# Altium project Sensor Breakout Board.PrjPcb
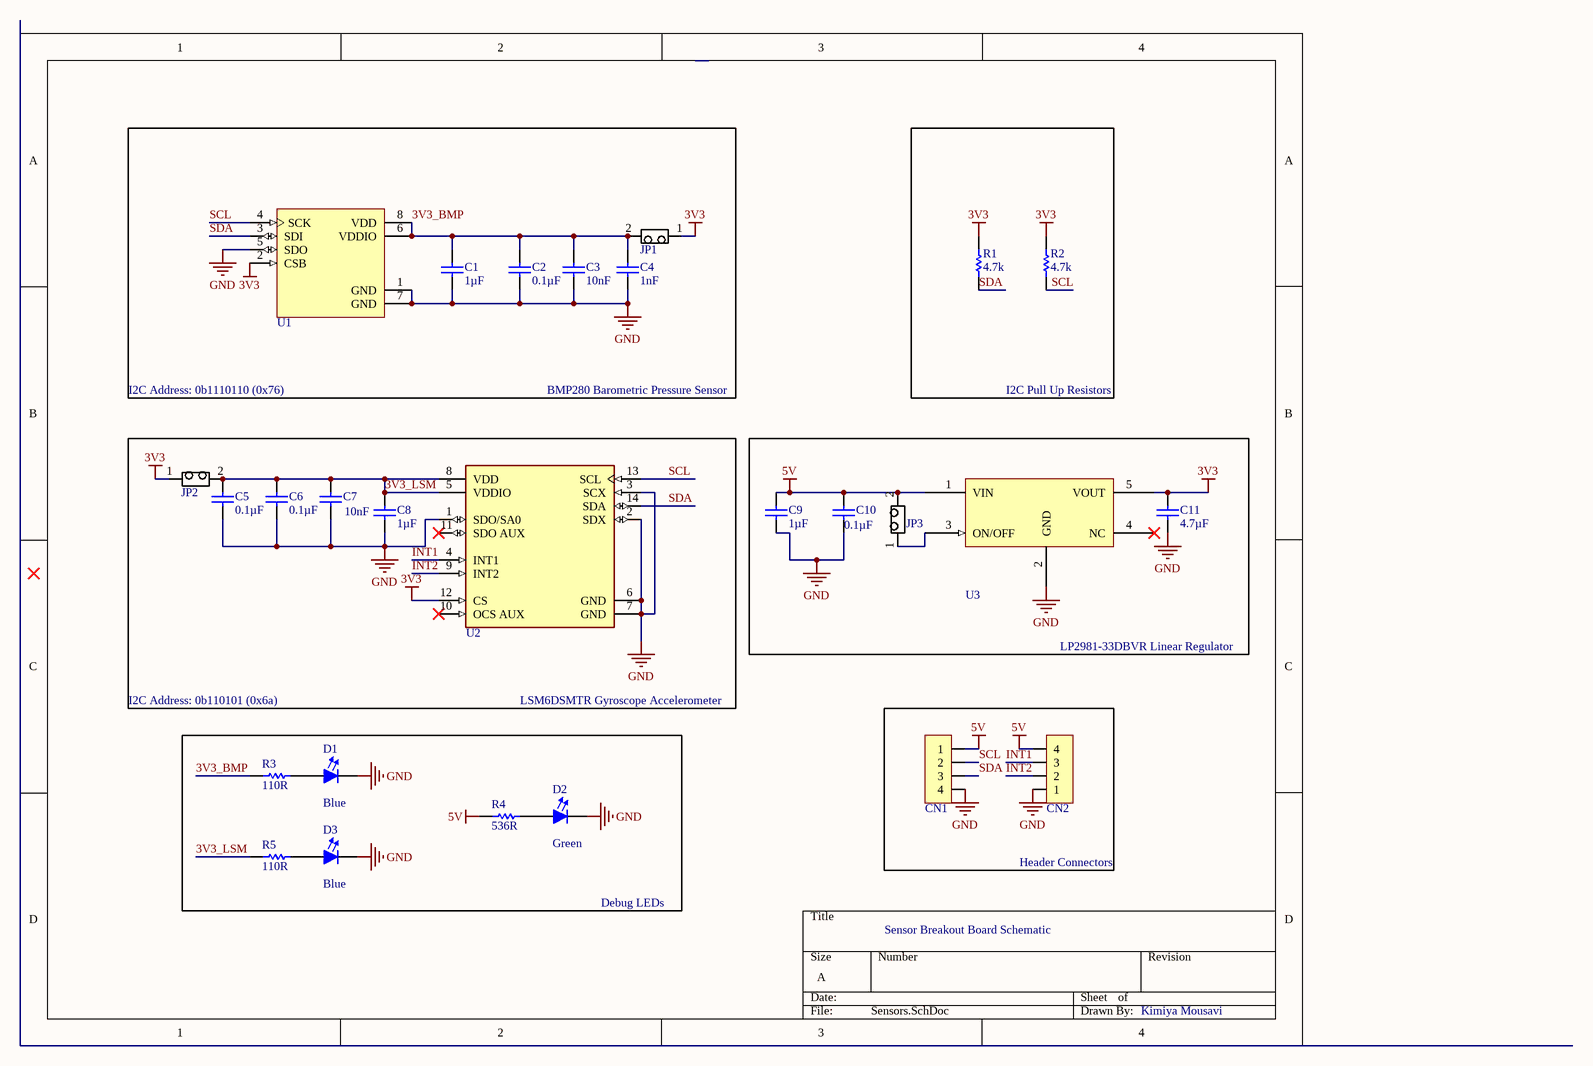
[diagram p0: Sensors.SchDoc]
1 sheet, 27 parts. Net scope: global (net labels, ports and power ports of the same name join across sheets).
Board file: Sensor Breakout.PcbDoc

## Sheet Sensors.SchDoc
size A

### Parts
C1  value 1µF  [CAPC1608N(0603")]  (hidden comment: 1uF 25V 0603 SMD, Ceramic)
C2  Capacitance: 0.1µF  [CAPC1608N(0603")]  (hidden comment: 0.1uF, 50V, 10%, X7R, 0603)
C3  value 10nF  [CAPC1608N(0603")]  (hidden comment: 10 nF, 50V 0603 SMD, Ceramic)
C4  value 1nF  [CAPC1608N(0603")]  (hidden comment: 1nF, Ceramic, 50V, +-1%, SMD, NP0)
C5  Capacitance: 0.1µF  [CAPC1608N(0603")]  (hidden comment: 0.1uF, 50V, 10%, X7R, 0603)
C6  Capacitance: 0.1µF  [CAPC1608N(0603")]  (hidden comment: 0.1uF, 50V, 10%, X7R, 0603)
C7  value 10nF  [CAPC1608N(0603")]  (hidden comment: 10 nF, 50V 0603 SMD, Ceramic)
C8  value 1µF  [CAPC1608N(0603")]  (hidden comment: 1uF 25V 0603 SMD, Ceramic)
C9  value 1µF  [CAPC1608N(0603")]  (hidden comment: 1uF 25V 0603 SMD, Ceramic)
C10  value 0.1µF  [CAPC1608N(0603")]  (hidden comment: 0.1uF 16V 0603 SMD, Ceramic)
C11  value 4.7µF  [CAPC1608N(0603")]  (hidden comment: 4.7uF 10V 0603 SMD, Ceramic)
CN1  Header, Male, 1x4  [Header, Male, 1X4]  (value not drawn)
CN2  Header, Male, 1x4  [Header, Male, 1X4]  (value not drawn)
D1  Color: Blue  [FP-LB_Q39E-MFG]  (hidden comment: LBQ39E-N1OO-35-1)
D2  Color: Green  [FP-LB_Q39E-MFG]  (hidden comment: LT Q39G-Q1OO-25-1)
D3  Color: Blue  [FP-LB_Q39E-MFG]  (hidden comment: LBQ39E-N1OO-35-1)
JP1  1x2 Male Header  [2X1 Males Header]  (value not drawn)
JP2  1x2 Male Header  [2X1 Males Header]  (value not drawn)
JP3  1x2 Male Header  [2X1 Males Header]  (value not drawn)
R1  value 4.7k  [RESC1608N(0603")]  (hidden comment: 4.7kR, 1%, 1/8W, 0603 SMD)
R2  value 4.7k  [RESC1608N(0603")]  (hidden comment: 4.7kR, 1%, 1/8W, 0603 SMD)
R3  Resistance: 110R  [RESC1608X55X25ML10T15]  (hidden comment: RC0603FR-07110RL)
R4  Resistance: 536R  [RESC1608X55X30LL15T15]  (hidden comment: ERJ-3EKF5360V)
R5  Resistance: 110R  [RESC1608X55X25ML10T15]  (hidden comment: RC0603FR-07110RL)
U1  BMP280 Barometric Pressure Sensor  [BOSC-LGA-8_V]  (value not drawn)
U2  LSM6DSMTR, Accelerometer/Gyroscope, LGA-14  [FP-LGA-14L-DM00249496-MFG]  (value not drawn)
U3  LP2981-33DBVR  [SOT95P280X145-5N]  (value not drawn)

### Blocks framed on the sheet
I2C Pull Up Resistors: R1 R2
LP2981-33DBVR Linear Regulator: C9-C11 JP3 U3
Debug LEDs: D1-D3 R3-R5
Header Connectors: CN1 CN2

### Nets
3V3: C11.2(Cathode) JP1.1 JP2.1 R1.2 R2.2 U1.2(CSB) U2.12(CS) U3.5(VOUT)
5V: C9.2(Cathode) C10.2(Cathode) CN1.1 CN2.4 JP3.2 R4.1 U3.1(VIN)
GND: C1.1(Anode) C2.1(Anode) C3.1(Anode) C4.1(Anode) C5.2(Cathode) C6.2(Cathode) C7.1(Anode) C8.1(Anode) C9.1(Anode) C10.1(Anode) C11.1(Anode) CN1.4 CN2.1 D1.1(Cathode) D2.1(Cathode) D3.1(Cathode) U1.1(GND) U1.5(SDO) U1.7(GND) U2.1(SDO/SA0) U2.2(SDX) U2.3(SCX) U2.6(GND) U2.7(GND) U3.2(GND)
3V3_BMP: C1.2(Cathode) C2.2(Cathode) C3.2(Cathode) C4.2(Cathode) JP1.2 R3.1 U1.6(VDDIO) U1.8(VDD)
3V3_LSM: C5.1(Anode) C6.1(Anode) C7.2(Cathode) C8.2(Cathode) JP2.2 R5.1 U2.5(VDDIO) U2.8(VDD)
INT1: CN2.3 U2.4(INT1)
INT2: CN2.2 U2.9(INT2)
SCL: CN1.2 R2.1 U1.4(SCK) U2.13(SCL)
SDA: CN1.3 R1.1 U1.3(SDI) U2.14(SDA)
NetD1_2: D1.2(Anode) R3.2
NetD2_2: D2.2(Anode) R4.2
NetD3_2: D3.2(Anode) R5.2
NetJP3_1: JP3.1 U3.3(ON/OFF)

Not connected (* = marked no-connect by the designer): U2 10(OCS_AUX)* 11(SDO_AUX)*; U3 4(NC)*

### Notes on the sheet
- I2C Address: 0b1110110 (0x76)
- BMP280 Barometric Pressure Sensor
- I2C Address: 0b110101 (0x6a)
- LSM6DSMTR Gyroscope Accelerometer
- Sensor Breakout Board Schematic
- Kimiya Mousavi

### Library data of the parts
C1 C8 C9 = CMP-006-0027-1: Capacitor, Ceramic, 25V, +/- 10%, 0603 SMD, X5R; MFG: Murata-Electronics-North-America; MFG#: GRM188R61E105KA12D; Created By: Andy Bates; Publisher: AUVic; Source: AUVic_Schematic_Library_Capacitors.SchLib; Component Type: Standard; Pin Count: 2; PackageDescription: Chip Capacitor; Design Item ID: 1uF 25V 0603 SMD, Ceramic; Published: 16-06-27
C2 C5 C6 = CMP-006-0007-1: 0.1µF ±10% Ceramic Capacitor X7R 0603 (1608 Metric); Operating Temperature: -55°C ~ 125°C; Pin Count: 2; Design Item ID: 0.1uF, 50V, 10%, X7R, 0603; Package / Case: 0603 (1608 Metric); Source: AUVic_Schematic_Library_Capacitors.SchLib; ComponentLink1URL: https://www.digikey.ca/product-detail/en/tdk-corporation/C1608X7R1H104M080AA/445-5098-1-ND/2093713; ComponentLink1Description: Digi-Key; Mounting Type: Surface Mount, MLCC; Component Type: Standard; Created By: Poorna Chander Kalidas
C3 C7 = CMP-006-0010-1: Capacitor, Ceramic, 50V, +/- 10%, 0603 SMD; MFG: Samsung; MFG#: GRM188R61A475KE15D; Created By: Gabriel; Design Item ID: 10 nF, 50V 0603 SMD, Ceramic; PackageDescription: Chip Capacitor; Source: AUVic_Schematic_Library_Capacitors.SchLib; Published: 16-06-23; Pin Count: 2; Publisher: AUVic; Component Type: Standard
C4 = CMP-006-0026-1: Capacitor, Ceramic, 50V, +-1%, 0603 SMD, NP0; Made By: Jordan Day; Date Created: 09/28/2016; Component Type: Standard; Source: AUVic_Schematic_Library_Capacitors.SchLib; Pin Count: 2; Design Item ID: 1nF, Ceramic, 50V, +-1%, SMD, NP0; Publisher: AUVic; PackageDescription: Chip Capacitor
C10 = CMP-006-0005-1: Capacitor, Ceramic, 16V, +/- 10%, 0603 SMD, X7R; Created By: Andy Bates; Published: 16-04-26; PackageDescription: Chip Capacitor; Pin Count: 2; Source: AUVic_Schematic_Library_Capacitors.SchLib; Design Item ID: 0.1uF 16V 0603 SMD, Ceramic; Component Type: Standard; Publisher: AUVic
C11 = CMP-006-0043-1: Capacitor, Ceramic, 10V, +/- 10%, 0603 SMD, X5R; MFG: Samsung; MFG#: GRM188R61A475KE15D; PackageDescription: Chip Capacitor; Source: AUVic_Schematic_Library_Capacitors.SchLib; Published: 16-06-23; Created By: Ashwin Sira; Component Type: Standard; Pin Count: 2; Publisher: AUVic; Design Item ID: 4.7uF 10V 0603 SMD, Ceramic
CN1 CN2 = CMP-005-0028-1: 1x4, Pads Pitch: 0.1" (2.54mm), Through hole; Made Bates: Andy Bates; Component Type: Standard; Design Item ID: Header, Male, 1x4; Source: AUVic_Schematic_Library_Connectors.SchLib; Pin Count: 4
D1 D3 = CMP-00063-3: LED BLUE DIFFUSED 0603 SMD; Luminous Flux: 0.13lm; Lens Size: 0.8mm; Lens Color: White; Viewing Angle: 130°; Luminous Intensity: 42mcd; Number of LEDs: 1; Dominant Wavelength: 470nm; Lens Style: Flat,Diffused,Colorless,Rectangular; Test Current: 5mA; Forward Voltage: 2.85V; Packaging: Tape and Reel; Case/Package: 0603; Height: 0.4mm; Number of Pins: 2; Mount: Surface Mount; Case Code (Metric): 1608; Case Code (Imperial): 0603; Lens Transparency: Diffused; Width: 0.8mm; Length: 1.6mm; Radiation Hardening: No
D2 = CMP-00064-3: LED GREEN DIFFUSED 0603 SMD; Dominant Wavelength: 530nm; Luminous Intensity: 280mcd; Lens Style: Diffused,Colorless,Rectangular; Number of LEDs: 1; Forward Voltage: 2.85V; Test Current: 5mA; Reverse Voltage: 5V; Forward Current: 15mA; Luminous Flux: 0.55lm; Radiation Hardening: No; Packaging: Tape and Reel; Mount: Surface Mount; Max Operating Temperature: 85°C; Number of Elements: 1; Number of Pins: 2; Min Operating Temperature: -40°C; Depth: 0.9mm; Case/Package: SMD/SMT; Length: 1.7mm
JP1-JP3 = CMP-004-0001-1: Made By: Andy Bates; Source: AUVic_Schematic_Library_Connectors.SchLib; Pin Count: 2; Design Item ID: 1x2 Male Header; Component Type: Standard
R1 R2 = CMP-047-0049-1: Owned By: AUVic; Made By: Ashwin Sira; Design Item ID: 4.7kR, 1%, 1/8W, 0603 SMD; Pin Count: 2; Created On: 14-05-31; Component Type: Standard; Source: AUVic_Schematic_Library_Resistors.SchLib; Last Edited: 14-05-31
R3 R5 = CMP-00069-1: RES SMD 110 OHM 1% 1/10W 0603; Max Power Dissipation: 100mW; Voltage Rating (DC): 50V; Temperature Coefficient: 100ppm/°C; Working Voltage: 75V; Military Standard: Not; Termination: SMD/SMT; Number of Terminations: 2; Features: Moisture Resistant; Min Operating Temperature: -55°C; Power Rating: 100mW; Height: 0.022inch; Package Quantity: 1; Lead Free: Lead Free; Tolerance: 1%; Voltage Rating: 50V; Composition: Thick Film; Case Code (Imperial): 0603; Length: 1.6mm; Packaging: Tape and Reel; Case Code (Metric): 1608; Max Operating Temperature: 155°C; Depth: 0.8mm; Case/Package: 0603; Width: 0.031inch
R4 = CMP-00071-1: SMD Chip Resistor, 0603 [1608 Metric], 536 ohm, ERJ3EK Series, 75 V, Thick Film, 100 mW; Tolerance: 1%; Voltage Rating (DC): 50V; Voltage Rating: 75V; Power Rating: 100mW; Temperature Coefficient: 100ppm/°C; Max Operating Temperature: 155°C; Package Quantity: 1; REACH SVHC: No SVHC; Depth: 0.8mm; Composition: Thick Film; Height: 0.022inch; Packaging: Tape and Reel; Contact Plating: Tin; Lead Free: Lead Free; Length: 1.6mm; Case/Package: 0603; Military Standard: Not; Features: Automotive AEC-Q200; Termination: SMD/SMT; Max Power Dissipation: 100mW; Width: 0.8mm; Mount: Surface Mount; Case Code (Metric): 1608; Case Code (Imperial): 0603; Number of Terminations: 2; Min Operating Temperature: -55°C
U1 = CMP-00103-3: BMP280 Absolute Barometric Pressure Sensor for Battery Powered Devices 2 x 2.5mm; Operating Pressure: 15.95PSI; Port Style: No Port; Output Type: SPI,I2C; Max Pressure: 290.08PSI; Pressure Type: Absolute; Termination: SMD/SMT; Case/Package: SMD/SMT; Min Operating Temperature: -40°C; Number of Pins: 8; Lead Free: Lead Free; Max Operating Temperature: 85°C
U2 = CMP-00100-1: IMU ACCEL/GYRO I2C/SPI 14LGA; Min Supply Voltage: 1.71V; Max Supply Voltage: 3.6V; Number of Pins: 14; Packaging: Cut Tape; Case/Package: LGA; REACH SVHC: No SVHC
U3 = CMP-044-0003-2: IC REG LINEAR 3.3V 100MA SOT23-5; Max Input Voltage: 16V; Min Input Voltage: 2.2V; Number of Regulators: 1; Output Voltage Accuracy: 2%; Polarity: Positive; Input Bias Current: 600uA; Output Type: Fixed; Dropout Voltage: 200mV; Package Quantity: 1; REACH SVHC: No SVHC; Output Voltage: 3.3V; Min Operating Temperature: -40°C; Case/Package: SOT-23; Max Output Current: 100mA; Lead Free: Lead Free; Max Operating Temperature: 125°C; Number of Outputs: 1; Number of Pins: 5; Mount: Surface Mount; Accuracy: 2%; Nominal Output Voltage: 3.3V; Output Current: 100mA; Packaging: Tape and Reel; Quiescent Current: 600uA; Radiation Hardening: No; Contact Plating: Tin,Matte